# Altium schematic sheet Selecteur.SchDoc: ClickBoard - Sélecteur
size Letter; ApprovedBy: K.C.; Author: Antoine Perron; Organization: Cegep Limoilou; Address1: 1300, 8e Avenue; Address2: Québec, QC; Address3: Canada; Address4: G1J 5L5; Revision: B3; SheetNumber: 4; SheetTotal: 5
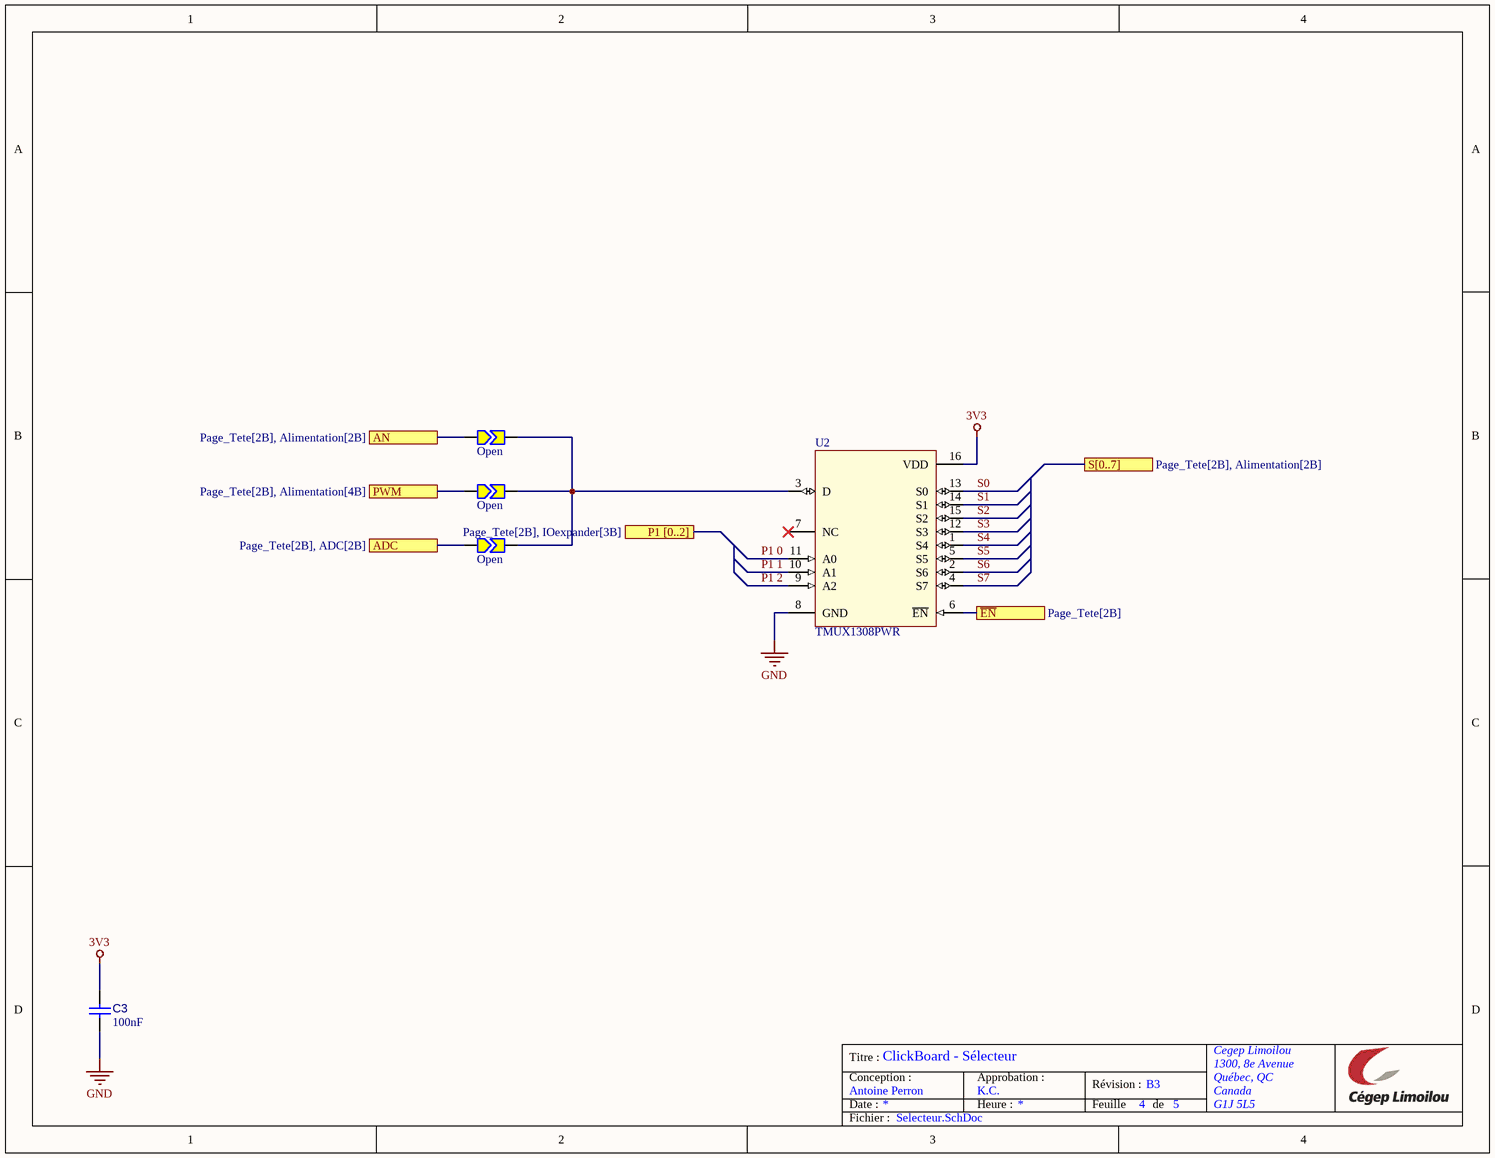
[diagram p0: Selecteur.SchDoc]

## Parts
C3  value 100nF  [C_1608[0603]]  (hidden comment: CAP CER 100nF 50V 0603)
SB1  Open  [SB-TINY-OPEN]  (no BOM)
SB2  Open  [SB-TINY-OPEN]  (no BOM)
SB3  Open  [SB-TINY-OPEN]  (no BOM)
U2  TMUX1308PWR  [U_TSSOP65P500X450-16]

## Ports
ADC (see Page_Tete[2B], ADC[2B]), AN (see Page_Tete[2B], Alimentation[2B]), P1 [0..2] (see Page_Tete[2B], IOexpander[3B]), PWM (see Page_Tete[2B], Alimentation[4B]), S[0..7] (see Page_Tete[2B], Alimentation[2B]), ~{EN} (see Page_Tete[2B])

## Nets
3V3: C3.2 U2.16(VDD)
GND: C3.1 U2.8(GND)
ADC: SB3.1 ; port ADC
AN: SB1.1 ; port AN
~{EN}: U2.6(~{EN}) ; port ~{EN}
P1 0: U2.11(A0)
P1 1: U2.10(A1)
P1 2: U2.9(A2)
PWM: SB2.1 ; port PWM
S0: U2.13(S0)
S1: U2.14(S1)
S2: U2.15(S2)
S3: U2.12(S3)
S4: U2.1(S4)
S5: U2.5(S5)
S6: U2.2(S6)
S7: U2.4(S7)
NetSB1_2: SB1.2 SB2.2 SB3.2 U2.3(D)

Not connected (* = marked no-connect by the designer): U2 7(NC)*

## Notes on the sheet
- Titre :
- Conception :
- Date :
- Approbation :
- Heure :
- Révision :
- Feuille
- de
- Fichier :

## Library data of the parts
C3 = CAP002: Capacitor type 1; Manufacturer 1: Yageo; Manufacturer Part Number 1: CC0603KRX7R9BB104; LibRef: CAP002; Code CEGEP: COND0143SM; Tolerance: 10%; Dielectric: X7R; Rated Voltage: 50V; Mounting Technology: SMT; Supplier 1: LCSC; Supplier Part Number 1: C14663
SB1-SB3 = Solder-Jumper-Open: Solder Jumper
U2 = U_TMUX1308PWR: IC MUX 8:1 195OHM 16TSSOP; Manufacturer 1: TI; Manufacturer Part Number 1: TMUX1308PWR; Mounting Technology: SMT; Supplier 1: LCSC; Supplier 2: Digikey; Supplier Part Number 1: C970231; Supplier Part Number 2: 296-TMUX1308PWRCT-ND